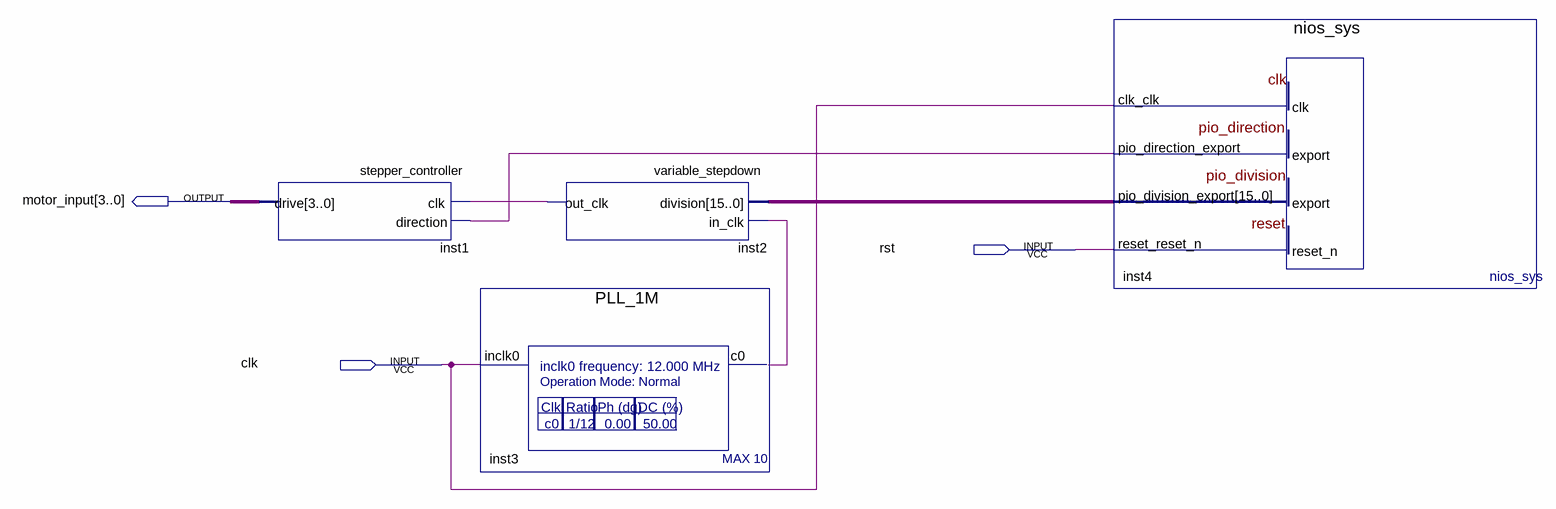
[diagram p0: schematic sheet]
// Quartus schematic unipolar_stepper.bdf as structural Verilog: 4 symbols, 3 pins
module unipolar_stepper (
  input  rst,
  input  clk,
  output [3:0] motor_input
);

  wire inst2_out_clk, inst3_c0, inst4_pio_direction_export;
  wire [15:0] inst4_pio_division_export;

  stepper_controller inst1 (.clk(inst2_out_clk), .direction(inst4_pio_direction_export), .drive(motor_input));
  PLL_1M inst3 (.inclk0(clk), .c0(inst3_c0));
  variable_stepdown inst2 (.division(inst4_pio_division_export), .in_clk(inst3_c0), .out_clk(inst2_out_clk));
  nios_sys inst4 (
    .clk_clk(clk), .reset_reset_n(rst), .pio_direction_export(inst4_pio_direction_export),
    .pio_division_export(inst4_pio_division_export));
endmodule
